# EAGLE design ArduSensor-Phototransistor (EAGLE 6.0)
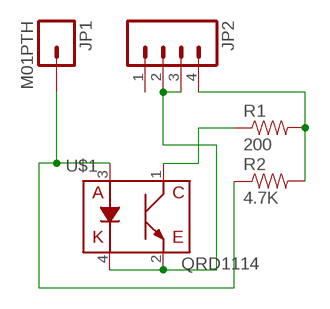
[diagram p0: schematic, sheet 1]

## Parts
JP1  M01PTH  [1X01]
JP2  M04PTH  [1X04]
R1  200  RESISTORAXIAL-0.3  [AXIAL-0.3]
R2  4.7K  RESISTORAXIAL-0.3  [AXIAL-0.3]
U$1  QRD1114  [QRD1114]

## Nets
N$1: JP1.1 R2.P$1 U$1.3(A)
N$2: R1.P$1 U$1.1(E)
N$3: JP2.2 JP2.3 U$1.2(C) U$1.4(K)
N$4: JP2.4 R1.P$2 R2.P$2
Unconnected: JP2.1

## Library data of the parts
JP1 = SFE Connectors:M01: Header 1 Standard 1-pin 0.1" header. Use with straight break away headers (SKU : PRT-00116), right angle break away headers (PRT-00553), swiss pins (PRT-00743), machine pins (PRT-00117), and female headers (PRT-00115).
JP2 = SFE Connectors:M04: Header 4 Standard 4-pin 0.1" header. Use with straight break away headers (SKU : PRT-00116), right angle break away headers (PRT-00553), swiss pins (PRT-00743), machine pins (PRT-00117), and female headers (PRT-00115). Molex polarized connector foot print use with SKU : PRT-08231 with associated crimp pins and housings. 1MM SMD Version SKU: PRT-10208
R1 R2 = SFE Passives:RESISTOR: Resistor Basic schematic elements and footprints for 0603, 1206, and PTH resistors.
U$1 = SFE Sensors:QRD1114: Reflective object sensor

## Board
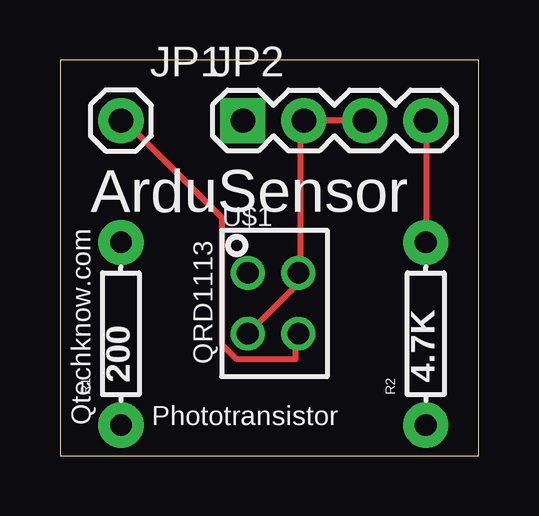
[diagram p1: board, top side]
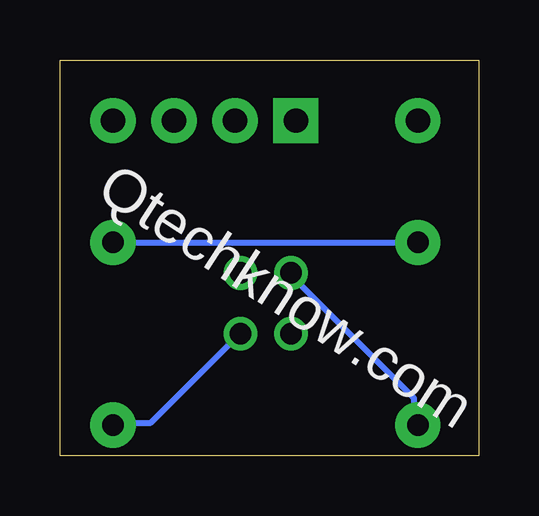
[diagram p2: board, bottom side, seen from below]

Size 17.45 x 16.5 mm. Coordinates in mm from the lower left corner, seen from the top.
Outline: 0,0 17.45,0 17.45,16.5 0,16.5 0,0
Copper layers (1*16): Top 0.035mm / dielectric 1.5mm / Bottom 0.035mm
Design rules: minimum track width 10mil, minimum drill 24mil, track to track 8mil, track to pad 8mil, pad to pad 8mil, via to via 8mil, smd to smd 8mil, copper to edge 40mil, drill to drill 8mil, minimum pad ring 10mil, minimum via ring 8mil, stop-mask expansion 4mil, vias tented up to drill 0mil, thermal gap 10mil

### Footprints (pad centres in the part's own frame; a part is rotated, then mirrored left to right if it is on the bottom)
1X01 = drill 1.016 pad 1.88: 1 0,0
1X04 = drill 1.016 pad 1.88 square: 1 0,0 | drill 1.016 pad 1.88: 2 2.54,0; 3 5.08,0; 4 7.62,0
AXIAL-0.3 = drill 0.9 pad 1.88: P$1 -3.81,0; P$2 3.81,0
QRD1114 = drill 0.9: 1 -1.067,1.27; 2 -1.067,-1.27; 3 1.041,-1.27; 4 1.041,1.27

### Placement (x,y rotation side)
JP1  2.54,13.97 0 top
JP2  7.62,13.97 0 top
R1  2.54,5.08 90 top
R2  15.24,5.08 90 top
U$1  8.89,6.35 0 top

### Tracks (layer width: path | path; a pad name or v marks a point on that pad's centre or on a via)
N$1
  Top 0.254: JP1.1 2.69,13.97 6.76,9.91 6.76,4.62 7.37,4.01 9.8,4.01 9.8,5.03 U$1.3
  Bottom 0.254: U$1.3 10.01,5.03 13.66,1.37 15.09,1.37 R2.P$1
N$2
  Bottom 0.254: U$1.1 7.77,7.47 2.69,2.39 2.69,1.37 R1.P$1
N$3
  Top 0.254: U$1.2 9.8,7.06 9.8,7.47 U$1.4 10.01,7.67 10.01,13.97 JP2.2 JP2.3
N$4
  Top 0.254: JP2.4 15.29,13.97 15.29,8.89 R2.P$2
  Bottom 0.254: R2.P$2 R1.P$2

### Text on the board
tPlace: ArduSensor | QRD1113 | Qtechknow.com | Phototransistor
bPlace: Qtechknow.com